# Altium schematic sheet 58. CURRENT MONITORS.SchDoc: CURRENT MONITORS - INA226
size 513 x 386 mm; Project: PROC154E2(001)_SK_AM69; Issue: 1.0; RevCode: E3; Page Create Date: March  8, 1995; Variant Name: Core Design; Schematic Page Number: 58; Page Number: 58; Page Size: C; Comment: MISTRAL_TITLEBLK_CSIZE_1; Page Count: 62; Schematic Page Count: 62; Name: PROC154E2 001 SK AM69; DsnPath: C:\Users\danie\Downloads\sprr466c\PROC154E3_RP\PROC154E3_SCH.DSN; SchematicName: SCHEMATIC1; PageName: 58. CURRENT MONITORS; PageSize: C; TopSchematic: True
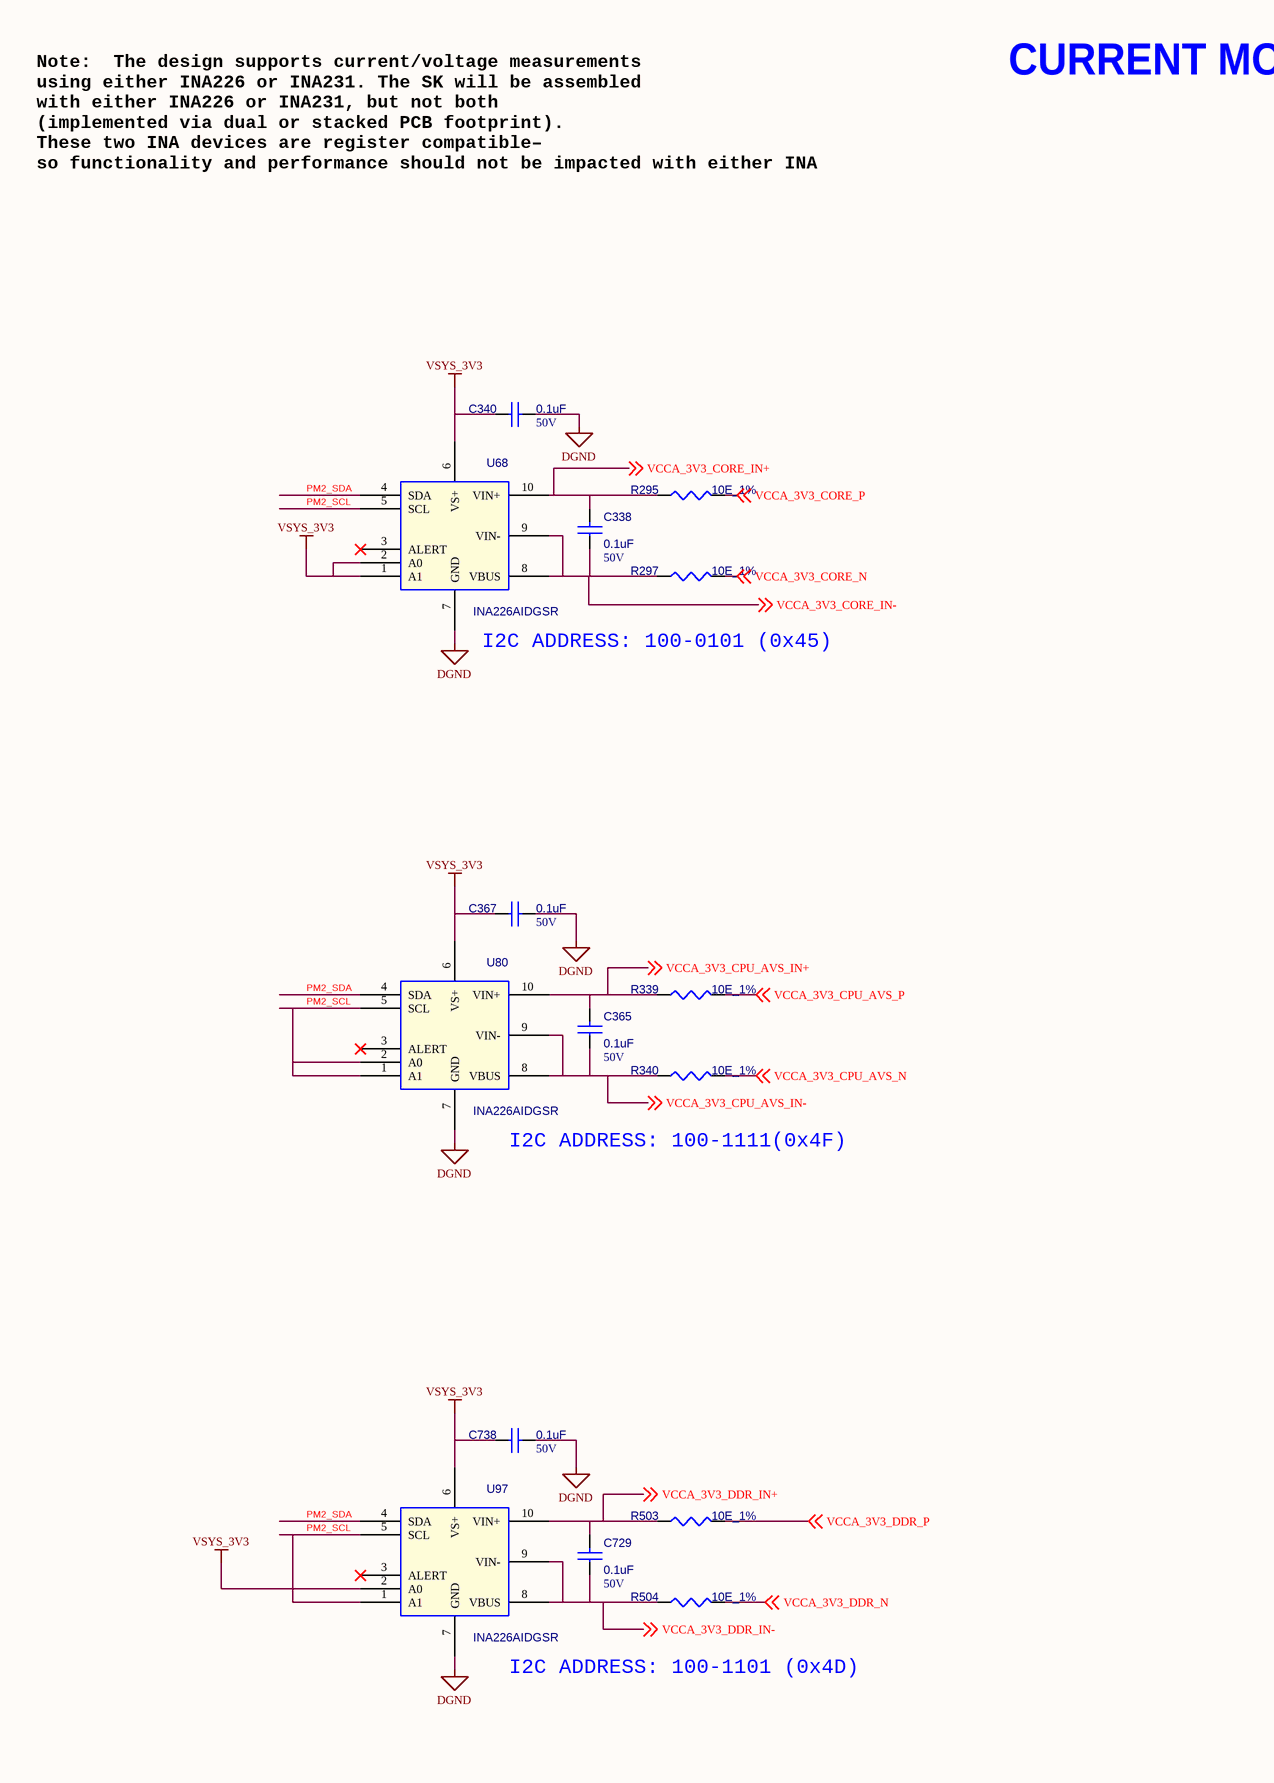
[diagram p0: 58. CURRENT MONITORS.SchDoc, left]
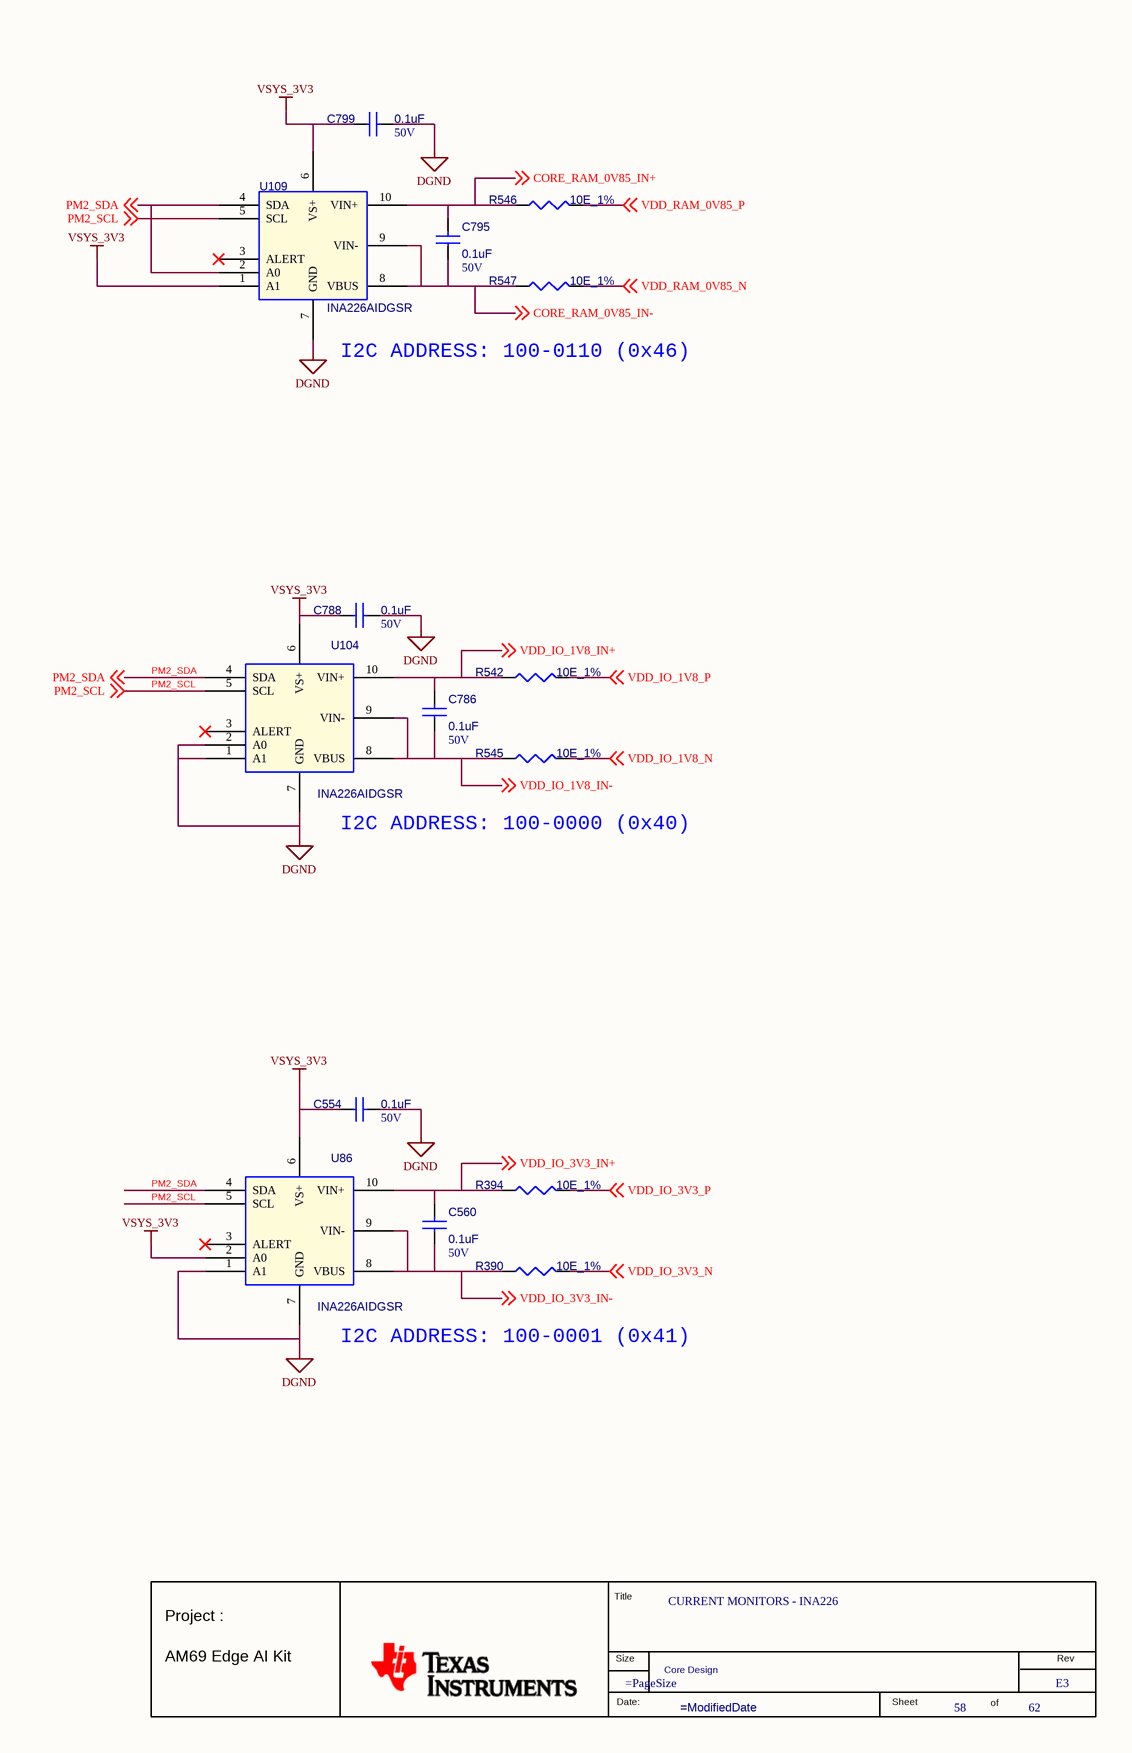
[diagram p1: 58. CURRENT MONITORS.SchDoc, right]

## Parts
*  RevCode: E3  Title: CURRENT MONITORS - INA226  Page Number: 58  Page Count: 62  Variant Name: Core Design  (hidden comment: MISTRAL_TITLEBLK_CSIZE_1)  (graphical)
C338  0.1uF  Voltage: 50V  [CAP0402_0-75]
C340  0.1uF  Voltage: 50V  [CAP0402_0-75]
C365  0.1uF  Voltage: 50V  [CAP0402_0-75]
C367  0.1uF  Voltage: 50V  [CAP0402_0-75]
C554  0.1uF  Voltage: 50V  [CAP0402_0-75]
C560  0.1uF  Voltage: 50V  [CAP0402_0-75]
C729  0.1uF  Voltage: 50V  [CAP0402_0-75]
C738  0.1uF  Voltage: 50V  [CAP0402_0-75]
C786  0.1uF  Voltage: 50V  [CAP0402_0-75]
C788  0.1uF  Voltage: 50V  [CAP0402_0-75]
C795  0.1uF  Voltage: 50V  [CAP0402_0-75]
C799  0.1uF  Voltage: 50V  [CAP0402_0-75]
R295  10E_1%  [RES0402_0-5]
R297  10E_1%  [RES0402_0-5]
R339  10E_1%  [RES0402_0-5]
R340  10E_1%  [RES0402_0-5]
R390  10E_1%  [RES0402_0-5]
R394  10E_1%  [RES0402_0-5]
R503  10E_1%  [RES0402_0-5]
R504  10E_1%  [RES0402_0-5]
R542  10E_1%  [RES0402_0-5]
R545  10E_1%  [RES0402_0-5]
R546  10E_1%  [RES0402_0-5]
R547  10E_1%  [RES0402_0-5]
U68  INA226AIDGSR  [MSOP10_19-68_120X120_1-1]
U80  INA226AIDGSR  [MSOP10_19-68_120X120_1-1]
U86  INA226AIDGSR  [MSOP10_19-68_120X120_1-1]
U97  INA226AIDGSR  [MSOP10_19-68_120X120_1-1]
U104  INA226AIDGSR  [MSOP10_19-68_120X120_1-1]
U109  INA226AIDGSR  [MSOP10_19-68_120X120_1-1]

## Nets
DGND: C340.2 C367.2 C554.2 C738.2 C788.2 C799.2 U68.7(GND) U80.7(GND) U86.1(A1) U86.7(GND) U97.7(GND) U104.1(A1) U104.2(A0) U104.7(GND) U109.7(GND)
VSYS_3V3: C340.1 C367.1 C554.1 C738.1 C788.1 C799.1 U68.1(A1) U68.2(A0) U68.6(VS+) U80.6(VS+) U86.2(A0) U86.6(VS+) U97.2(A0) U97.6(VS+) U104.6(VS+) U109.1(A1) U109.6(VS+)
CORE_RAM_0V85_IN+: C795.2 R546.1 U109.10(VIN+) ; off-sheet CORE_RAM_0V85_IN+
CORE_RAM_0V85_IN-: C795.1 R547.1 U109.8(VBUS) U109.9(VIN-) ; off-sheet CORE_RAM_0V85_IN-
PM2_SCL: U68.5(SCL) U80.1(A1) U80.2(A0) U80.5(SCL) U86.5(SCL) U97.1(A1) U97.5(SCL) U104.5(SCL) U109.5(SCL) ; off-sheet PM2_SCL
PM2_SDA: U68.4(SDA) U80.4(SDA) U86.4(SDA) U97.4(SDA) U104.4(SDA) U109.2(A0) U109.4(SDA) ; off-sheet PM2_SDA
VCCA_3V3_CORE_IN+: C338.2 R295.1 U68.10(VIN+) ; off-sheet VCCA_3V3_CORE_IN+
VCCA_3V3_CORE_IN-: C338.1 R297.1 U68.8(VBUS) U68.9(VIN-) ; off-sheet VCCA_3V3_CORE_IN-
VCCA_3V3_CORE_N: R297.2 ; off-sheet VCCA_3V3_CORE_N
VCCA_3V3_CORE_P: R295.2 ; off-sheet VCCA_3V3_CORE_P
VCCA_3V3_CPU_AVS_IN+: C365.2 R339.1 U80.10(VIN+) ; off-sheet VCCA_3V3_CPU_AVS_IN+
VCCA_3V3_CPU_AVS_IN-: C365.1 R340.1 U80.8(VBUS) U80.9(VIN-) ; off-sheet VCCA_3V3_CPU_AVS_IN-
VCCA_3V3_CPU_AVS_N: R340.2 ; off-sheet VCCA_3V3_CPU_AVS_N
VCCA_3V3_CPU_AVS_P: R339.2 ; off-sheet VCCA_3V3_CPU_AVS_P
VCCA_3V3_DDR_IN+: C729.2 R503.1 U97.10(VIN+) ; off-sheet VCCA_3V3_DDR_IN+
VCCA_3V3_DDR_IN-: C729.1 R504.1 U97.8(VBUS) U97.9(VIN-) ; off-sheet VCCA_3V3_DDR_IN-
VCCA_3V3_DDR_N: R504.2 ; off-sheet VCCA_3V3_DDR_N
VCCA_3V3_DDR_P: R503.2 ; off-sheet VCCA_3V3_DDR_P
VDD_IO_1V8_IN+: C786.2 R542.1 U104.10(VIN+) ; off-sheet VDD_IO_1V8_IN+
VDD_IO_1V8_IN-: C786.1 R545.1 U104.8(VBUS) U104.9(VIN-) ; off-sheet VDD_IO_1V8_IN-
VDD_IO_1V8_N: R545.2 ; off-sheet VDD_IO_1V8_N
VDD_IO_1V8_P: R542.2 ; off-sheet VDD_IO_1V8_P
VDD_IO_3V3_IN+: C560.2 R394.1 U86.10(VIN+) ; off-sheet VDD_IO_3V3_IN+
VDD_IO_3V3_IN-: C560.1 R390.1 U86.8(VBUS) U86.9(VIN-) ; off-sheet VDD_IO_3V3_IN-
VDD_IO_3V3_N: R390.2 ; off-sheet VDD_IO_3V3_N
VDD_IO_3V3_P: R394.2 ; off-sheet VDD_IO_3V3_P
VDD_RAM_0V85_N: R547.2 ; off-sheet VDD_RAM_0V85_N
VDD_RAM_0V85_P: R546.2 ; off-sheet VDD_RAM_0V85_P

Not connected (* = marked no-connect by the designer): U68 3(ALERT)*; U80 3(ALERT)*; U86 3(ALERT)*; U97 3(ALERT)*; U104 3(ALERT)*; U109 3(ALERT)*

## Notes on the sheet
- Note:  The design supports current/voltage measurements
  using either INA226 or INA231. The SK will be assembled
  with either INA226 or INA231, but not both
  (implemented via dual or stacked PCB footprint).
  These two INA devices are register compatible–
  so functionality and performance should not be impacted with either INA
- CURRENT MONITORS - INA226
- I2C ADDRESS: 100-0101 (0x45)
- I2C ADDRESS: 100-0110 (0x46)
- I2C ADDRESS: 100-1111(0x4F)
- I2C ADDRESS: 100-0000 (0x40)
- I2C ADDRESS: 100-0001 (0x41)
- I2C ADDRESS: 100-1101 (0x4D)
- (in symbol MISTRAL_TITLEBLK_CSIZE_1) Title; Project :; Size; Rev; AM69 Edge AI Kit; Date:; Sheet; of

## Library data of the parts
* = MISTRAL_TITLEBLK_CSIZE_1: Issue: 1.0; Project: PROC154E2(001)_SK_AM69; Name: PROC154E2 001 SK AM69; Page Create Date: March  8, 1995; Page Size: =PageSize; Page Modify Date: =ModifiedDate; Schematic Page Count: 62; Schematic Page Number: 58
C338 = CAP_Dup1: CAP CERAMIC 0.1uF 50V 10% X7R 0402; Part Reference: C338; Manufacturer: MURATA; Part_type: CAPACITORS\CERAMIC; Mfr_part_number: GRM155R71H104KE14D; Mistral Part No: 120011100014-R; Direct Alternate_mfr_name: TDK; Direct Alternate_mfr_part_number: C1005X7R1H104K050BE; Automotive Alternate_mfr_part_number: CGA2B3X7R1H104K050BB; Custom_Duty: 15%; Customs_HS_Code: 85322990; Wattage: NA; Project: J7_CP; Value: 0.1uF; PCB Footprint: CAP0402_0-75; MECHANICAL 3D STEP FILE: CAP0402_0-75; Chkd/date: MANIRAJA/261020; Crtd /date: ALVY/211020; Datasheet: Y:\MIS_DATABASE\DATASHEETS\CAPACITORS\GRM155R71H104KE14.PDF; Temperature: -55°C+125°C; Weight: 3.1mg; Height: 0.55MM; Distributor_part_number: 490-10700-1-ND; Distributor_name: DIGIKEY; Package: 0402; Tolerance: 10%; Mfr_name: MURATA; Library Ref: CAP; Footprint Ref: CAP0402_0-75; Library Path: Y:\MIS_DATABASE\Library\ALTIUM_TOOL\SCHEMATICS_PARTS\MS_DISCRETE_Library.schlib; Footprint Path: Y:\MIS_DATABASE\Library\ALTIUM_TOOL\PCB_FOOTPRINTS\Altium_Footprint_Lib.PcbLib; Automotive Alternate_mfr_name: TDK
C340 = CAP_Dup1: CAP CERAMIC 0.1uF 50V 10% X7R 0402; Part Reference: C340; Manufacturer: MURATA; Mistral Part No: 120011100014-R; Mfr_part_number: GRM155R71H104KE14D; Part_type: CAPACITORS\CERAMIC; Direct Alternate_mfr_name: TDK; Direct Alternate_mfr_part_number: C1005X7R1H104K050BE; Automotive Alternate_mfr_part_number: CGA2B3X7R1H104K050BB; Project: J7_CP; Wattage: NA; Customs_HS_Code: 85322990; Custom_Duty: 15%; Value: 0.1uF; PCB Footprint: CAP0402_0-75; MECHANICAL 3D STEP FILE: CAP0402_0-75; Footprint Path: Y:\MIS_DATABASE\Library\ALTIUM_TOOL\PCB_FOOTPRINTS\Altium_Footprint_Lib.PcbLib; Library Path: Y:\MIS_DATABASE\Library\ALTIUM_TOOL\SCHEMATICS_PARTS\MS_DISCRETE_Library.schlib; Footprint Ref: CAP0402_0-75; Library Ref: CAP; Mfr_name: MURATA; Tolerance: 10%; Package: 0402; Distributor_name: DIGIKEY; Distributor_part_number: 490-10700-1-ND; Height: 0.55MM; Weight: 3.1mg; Temperature: -55°C+125°C; Datasheet: Y:\MIS_DATABASE\DATASHEETS\CAPACITORS\GRM155R71H104KE14.PDF; Crtd /date: ALVY/211020; Chkd/date: MANIRAJA/261020; Automotive Alternate_mfr_name: TDK
C365 = CAP_Dup1: CAP CERAMIC 0.1uF 50V 10% X7R 0402; Part Reference: C365; Manufacturer: MURATA; Automotive Alternate_mfr_part_number: CGA2B3X7R1H104K050BB; Automotive Alternate_mfr_name: TDK; Direct Alternate_mfr_part_number: C1005X7R1H104K050BE; Part_type: CAPACITORS\CERAMIC; Mfr_part_number: GRM155R71H104KE14D; Mistral Part No: 120011100014-R; Custom_Duty: 15%; Customs_HS_Code: 85322990; Wattage: NA; Project: J7_CP; Value: 0.1uF; PCB Footprint: CAP0402_0-75; Direct Alternate_mfr_name: TDK; Chkd/date: MANIRAJA/261020; Crtd /date: ALVY/211020; Datasheet: Y:\MIS_DATABASE\DATASHEETS\CAPACITORS\GRM155R71H104KE14.PDF; Temperature: -55°C+125°C; Weight: 3.1mg; Height: 0.55MM; Distributor_part_number: 490-10700-1-ND; Distributor_name: DIGIKEY; Package: 0402; Tolerance: 10%; Mfr_name: MURATA; Library Ref: CAP; Footprint Ref: CAP0402_0-75; Library Path: Y:\MIS_DATABASE\Library\ALTIUM_TOOL\SCHEMATICS_PARTS\MS_DISCRETE_Library.schlib; Footprint Path: Y:\MIS_DATABASE\Library\ALTIUM_TOOL\PCB_FOOTPRINTS\Altium_Footprint_Lib.PcbLib; MECHANICAL 3D STEP FILE: CAP0402_0-75
C367 = CAP_Dup1: CAP CERAMIC 0.1uF 50V 10% X7R 0402; Part Reference: C367; Manufacturer: MURATA; Automotive Alternate_mfr_part_number: CGA2B3X7R1H104K050BB; Automotive Alternate_mfr_name: TDK; Direct Alternate_mfr_part_number: C1005X7R1H104K050BE; Mistral Part No: 120011100014-R; Mfr_part_number: GRM155R71H104KE14D; Part_type: CAPACITORS\CERAMIC; Project: J7_CP; Wattage: NA; Customs_HS_Code: 85322990; Custom_Duty: 15%; Value: 0.1uF; PCB Footprint: CAP0402_0-75; Direct Alternate_mfr_name: TDK; Footprint Path: Y:\MIS_DATABASE\Library\ALTIUM_TOOL\PCB_FOOTPRINTS\Altium_Footprint_Lib.PcbLib; Library Path: Y:\MIS_DATABASE\Library\ALTIUM_TOOL\SCHEMATICS_PARTS\MS_DISCRETE_Library.schlib; Footprint Ref: CAP0402_0-75; Library Ref: CAP; Mfr_name: MURATA; Tolerance: 10%; Package: 0402; Distributor_name: DIGIKEY; Distributor_part_number: 490-10700-1-ND; Height: 0.55MM; Weight: 3.1mg; Temperature: -55°C+125°C; Datasheet: Y:\MIS_DATABASE\DATASHEETS\CAPACITORS\GRM155R71H104KE14.PDF; Crtd /date: ALVY/211020; Chkd/date: MANIRAJA/261020; MECHANICAL 3D STEP FILE: CAP0402_0-75
C554 = CAP_Dup1: CAP CERAMIC 0.1uF 50V 10% X7R 0402; Part Reference: C554; Manufacturer: MURATA; Mistral Part No: 120011100014-R; Mfr_part_number: GRM155R71H104KE14D; Part_type: CAPACITORS\CERAMIC; Direct Alternate_mfr_name: TDK; Direct Alternate_mfr_part_number: C1005X7R1H104K050BE; Automotive Alternate_mfr_part_number: CGA2B3X7R1H104K050BB; Project: J7_CP; Wattage: NA; Customs_HS_Code: 85322990; Custom_Duty: 15%; Value: 0.1uF; PCB Footprint: CAP0402_0-75; MECHANICAL 3D STEP FILE: CAP0402_0-75; Footprint Path: Y:\MIS_DATABASE\Library\ALTIUM_TOOL\PCB_FOOTPRINTS\Altium_Footprint_Lib.PcbLib; Library Path: Y:\MIS_DATABASE\Library\ALTIUM_TOOL\SCHEMATICS_PARTS\MS_DISCRETE_Library.schlib; Footprint Ref: CAP0402_0-75; Library Ref: CAP; Mfr_name: MURATA; Tolerance: 10%; Package: 0402; Distributor_name: DIGIKEY; Distributor_part_number: 490-10700-1-ND; Height: 0.55MM; Weight: 3.1mg; Temperature: -55°C+125°C; Datasheet: Y:\MIS_DATABASE\DATASHEETS\CAPACITORS\GRM155R71H104KE14.PDF; Crtd /date: ALVY/211020; Chkd/date: MANIRAJA/261020; Automotive Alternate_mfr_name: TDK
C560 = CAP_Dup1: CAP CERAMIC 0.1uF 50V 10% X7R 0402; Part Reference: C560; Manufacturer: MURATA; Part_type: CAPACITORS\CERAMIC; Mfr_part_number: GRM155R71H104KE14D; Mistral Part No: 120011100014-R; Direct Alternate_mfr_name: TDK; Direct Alternate_mfr_part_number: C1005X7R1H104K050BE; Automotive Alternate_mfr_part_number: CGA2B3X7R1H104K050BB; Custom_Duty: 15%; Customs_HS_Code: 85322990; Wattage: NA; Project: J7_CP; Value: 0.1uF; PCB Footprint: CAP0402_0-75; MECHANICAL 3D STEP FILE: CAP0402_0-75; Chkd/date: MANIRAJA/261020; Crtd /date: ALVY/211020; Datasheet: Y:\MIS_DATABASE\DATASHEETS\CAPACITORS\GRM155R71H104KE14.PDF; Temperature: -55°C+125°C; Weight: 3.1mg; Height: 0.55MM; Distributor_part_number: 490-10700-1-ND; Distributor_name: DIGIKEY; Package: 0402; Tolerance: 10%; Mfr_name: MURATA; Library Ref: CAP; Footprint Ref: CAP0402_0-75; Library Path: Y:\MIS_DATABASE\Library\ALTIUM_TOOL\SCHEMATICS_PARTS\MS_DISCRETE_Library.schlib; Footprint Path: Y:\MIS_DATABASE\Library\ALTIUM_TOOL\PCB_FOOTPRINTS\Altium_Footprint_Lib.PcbLib; Automotive Alternate_mfr_name: TDK
C729 = CAP_Dup1: CAP CERAMIC 0.1uF 50V 10% X7R 0402; Part Reference: C729; Mistral Part No: 120011100014-R; Mfr_name: MURATA; Mfr_part_number: GRM155R71H104KE14D; Part_type: CAPACITORS\CERAMIC; Direct Alternate_mfr_name: TDK; Direct Alternate_mfr_part_number: C1005X7R1H104K050BE; Automotive Alternate_mfr_part_number: CGA2B3X7R1H104K050BB; Project: J7_CP; Wattage: NA; Customs_HS_Code: 85322990; Custom_Duty: 15%; Value: 0.1uF; PCB Footprint: CAP0402_0-75; MECHANICAL 3D STEP FILE: CAP0402_0-75; Footprint Path: Y:\MIS_DATABASE\Library\ALTIUM_TOOL\PCB_FOOTPRINTS\Altium_Footprint_Lib.PcbLib; Library Path: Y:\MIS_DATABASE\Library\ALTIUM_TOOL\SCHEMATICS_PARTS\MS_DISCRETE_Library.schlib; Footprint Ref: CAP0402_0-75; Library Ref: CAP; Tolerance: 10%; Package: 0402; Distributor_name: DIGIKEY; Distributor_part_number: 490-10700-1-ND; Height: 0.55MM; Weight: 3.1mg; Temperature: -55°C+125°C; Datasheet: Y:\MIS_DATABASE\DATASHEETS\CAPACITORS\GRM155R71H104KE14.PDF; Crtd /date: ALVY/211020; Chkd/date: MANIRAJA/261020; Automotive Alternate_mfr_name: TDK; Manufacturer: MURATA
C738 = CAP_Dup1: CAP CERAMIC 0.1uF 50V 10% X7R 0402; Part Reference: C738; Part_type: CAPACITORS\CERAMIC; Mfr_part_number: GRM155R71H104KE14D; Mfr_name: MURATA; Mistral Part No: 120011100014-R; Direct Alternate_mfr_name: TDK; Direct Alternate_mfr_part_number: C1005X7R1H104K050BE; Automotive Alternate_mfr_part_number: CGA2B3X7R1H104K050BB; Custom_Duty: 15%; Customs_HS_Code: 85322990; Wattage: NA; Project: J7_CP; Value: 0.1uF; PCB Footprint: CAP0402_0-75; MECHANICAL 3D STEP FILE: CAP0402_0-75; Chkd/date: MANIRAJA/261020; Crtd /date: ALVY/211020; Datasheet: Y:\MIS_DATABASE\DATASHEETS\CAPACITORS\GRM155R71H104KE14.PDF; Temperature: -55°C+125°C; Weight: 3.1mg; Height: 0.55MM; Distributor_part_number: 490-10700-1-ND; Distributor_name: DIGIKEY; Package: 0402; Tolerance: 10%; Library Ref: CAP; Footprint Ref: CAP0402_0-75; Library Path: Y:\MIS_DATABASE\Library\ALTIUM_TOOL\SCHEMATICS_PARTS\MS_DISCRETE_Library.schlib; Footprint Path: Y:\MIS_DATABASE\Library\ALTIUM_TOOL\PCB_FOOTPRINTS\Altium_Footprint_Lib.PcbLib; Automotive Alternate_mfr_name: TDK; Manufacturer: MURATA
C786 = CAP_Dup1: CAP CERAMIC 0.1uF 50V 10% X7R 0402; Part Reference: C786; Automotive Alternate_mfr_part_number: CGA2B3X7R1H104K050BB; Automotive Alternate_mfr_name: TDK; Direct Alternate_mfr_part_number: C1005X7R1H104K050BE; Mistral Part No: 120011100014-R; Mfr_name: MURATA; Mfr_part_number: GRM155R71H104KE14D; Part_type: CAPACITORS\CERAMIC; Project: J7_CP; Wattage: NA; Customs_HS_Code: 85322990; Custom_Duty: 15%; Value: 0.1uF; PCB Footprint: CAP0402_0-75; Direct Alternate_mfr_name: TDK; Footprint Path: Y:\MIS_DATABASE\Library\ALTIUM_TOOL\PCB_FOOTPRINTS\Altium_Footprint_Lib.PcbLib; Library Path: Y:\MIS_DATABASE\Library\ALTIUM_TOOL\SCHEMATICS_PARTS\MS_DISCRETE_Library.schlib; Footprint Ref: CAP0402_0-75; Library Ref: CAP; Tolerance: 10%; Package: 0402; Distributor_name: DIGIKEY; Distributor_part_number: 490-10700-1-ND; Height: 0.55MM; Weight: 3.1mg; Temperature: -55°C+125°C; Datasheet: Y:\MIS_DATABASE\DATASHEETS\CAPACITORS\GRM155R71H104KE14.PDF; Crtd /date: ALVY/211020; Chkd/date: MANIRAJA/261020; MECHANICAL 3D STEP FILE: CAP0402_0-75; Manufacturer: MURATA
C788 = CAP_Dup1: CAP CERAMIC 0.1uF 50V 10% X7R 0402; Part Reference: C788; Mistral Part No: 120011100014-R; Mfr_name: MURATA; Mfr_part_number: GRM155R71H104KE14D; Part_type: CAPACITORS\CERAMIC; Direct Alternate_mfr_name: TDK; Direct Alternate_mfr_part_number: C1005X7R1H104K050BE; Automotive Alternate_mfr_part_number: CGA2B3X7R1H104K050BB; Project: J7_CP; Wattage: NA; Customs_HS_Code: 85322990; Custom_Duty: 15%; Value: 0.1uF; PCB Footprint: CAP0402_0-75; MECHANICAL 3D STEP FILE: CAP0402_0-75; Footprint Path: Y:\MIS_DATABASE\Library\ALTIUM_TOOL\PCB_FOOTPRINTS\Altium_Footprint_Lib.PcbLib; Library Path: Y:\MIS_DATABASE\Library\ALTIUM_TOOL\SCHEMATICS_PARTS\MS_DISCRETE_Library.schlib; Footprint Ref: CAP0402_0-75; Library Ref: CAP; Tolerance: 10%; Package: 0402; Distributor_name: DIGIKEY; Distributor_part_number: 490-10700-1-ND; Height: 0.55MM; Weight: 3.1mg; Temperature: -55°C+125°C; Datasheet: Y:\MIS_DATABASE\DATASHEETS\CAPACITORS\GRM155R71H104KE14.PDF; Crtd /date: ALVY/211020; Chkd/date: MANIRAJA/261020; Automotive Alternate_mfr_name: TDK; Manufacturer: MURATA
C795 = CAP_Dup1: CAP CERAMIC 0.1uF 50V 10% X7R 0402; Part Reference: C795; Automotive Alternate_mfr_part_number: CGA2B3X7R1H104K050BB; Automotive Alternate_mfr_name: TDK; Direct Alternate_mfr_part_number: C1005X7R1H104K050BE; Part_type: CAPACITORS\CERAMIC; Mfr_part_number: GRM155R71H104KE14D; Mfr_name: MURATA; Mistral Part No: 120011100014-R; Custom_Duty: 15%; Customs_HS_Code: 85322990; Wattage: NA; Project: J7_CP; Value: 0.1uF; PCB Footprint: CAP0402_0-75; Direct Alternate_mfr_name: TDK; MECHANICAL 3D STEP FILE: CAP0402_0-75; Chkd/date: MANIRAJA/261020; Crtd /date: ALVY/211020; Datasheet: Y:\MIS_DATABASE\DATASHEETS\CAPACITORS\GRM155R71H104KE14.PDF; Temperature: -55°C+125°C; Weight: 3.1mg; Height: 0.55MM; Distributor_part_number: 490-10700-1-ND; Distributor_name: DIGIKEY; Package: 0402; Tolerance: 10%; Library Ref: CAP; Footprint Ref: CAP0402_0-75; Library Path: Y:\MIS_DATABASE\Library\ALTIUM_TOOL\SCHEMATICS_PARTS\MS_DISCRETE_Library.schlib; Footprint Path: Y:\MIS_DATABASE\Library\ALTIUM_TOOL\PCB_FOOTPRINTS\Altium_Footprint_Lib.PcbLib; Manufacturer: MURATA
C799 = CAP_Dup1: CAP CERAMIC 0.1uF 50V 10% X7R 0402; Part Reference: C799; Automotive Alternate_mfr_part_number: CGA2B3X7R1H104K050BB; Automotive Alternate_mfr_name: TDK; Direct Alternate_mfr_part_number: C1005X7R1H104K050BE; Mistral Part No: 120011100014-R; Mfr_name: MURATA; Mfr_part_number: GRM155R71H104KE14D; Part_type: CAPACITORS\CERAMIC; Project: J7_CP; Wattage: NA; Customs_HS_Code: 85322990; Custom_Duty: 15%; Value: 0.1uF; PCB Footprint: CAP0402_0-75; Direct Alternate_mfr_name: TDK; MECHANICAL 3D STEP FILE: CAP0402_0-75; Footprint Path: Y:\MIS_DATABASE\Library\ALTIUM_TOOL\PCB_FOOTPRINTS\Altium_Footprint_Lib.PcbLib; Library Path: Y:\MIS_DATABASE\Library\ALTIUM_TOOL\SCHEMATICS_PARTS\MS_DISCRETE_Library.schlib; Footprint Ref: CAP0402_0-75; Library Ref: CAP; Tolerance: 10%; Package: 0402; Distributor_name: DIGIKEY; Distributor_part_number: 490-10700-1-ND; Height: 0.55MM; Weight: 3.1mg; Temperature: -55°C+125°C; Datasheet: Y:\MIS_DATABASE\DATASHEETS\CAPACITORS\GRM155R71H104KE14.PDF; Crtd /date: ALVY/211020; Chkd/date: MANIRAJA/261020; Manufacturer: MURATA
R295 = RESISTOR_Dup2: RES 10E 1/10W 1% 0402; Part Reference: R295; Manufacturer: PANASONIC-ECG; Mistral Part No: 110009030203-R; Mfr_part_number: ERJ-2RKF10R0X; Part_type: RESISTORS\FIXED; Project: CTP02_REVA_BASE; Voltage: NA; Customs_HS_Code: 85332119; Custom_Duty: 15%; Value: 10E_1%; PCB Footprint: RES0402_0-5; Footprint Ref: RES0402_0-5; Mfr_name: PANASONIC-ECG; Tolerance: 1%; Wattage: 1/10W; Package: 0402; Distributor_name: DIGIKEY; Distributor_part_number: P10.0LCT-ND; Library Ref: RESISTOR; Height: 0.40MM; Weight: 0.8mg; Temperature: -55°C+155°C; Datasheet: Y:\MIS_DATABASE\DATASHEETS\RESISTORS\PAN-ERJSER_NOV17.PDF; Crtd /date: MAZHAR/120505; Chkd/date: VASANTHA/201216; MECHANICAL 3D STEP FILE: RES0402_0-5; Library Path: Y:\MIS_DATABASE\Library\ALTIUM_TOOL\SCHEMATICS_PARTS\MS_DISCRETE_Library.schlib; Footprint Path: Y:\MIS_DATABASE\Library\ALTIUM_TOOL\PCB_FOOTPRINTS\Altium_Footprint_Lib.PcbLib
R297 = RESISTOR_Dup2: RES 10E 1/10W 1% 0402; Part Reference: R297; Manufacturer: PANASONIC-ECG; Part_type: RESISTORS\FIXED; Mfr_part_number: ERJ-2RKF10R0X; Mistral Part No: 110009030203-R; Custom_Duty: 15%; Customs_HS_Code: 85332119; Voltage: NA; Project: CTP02_REVA_BASE; Value: 10E_1%; PCB Footprint: RES0402_0-5; Footprint Path: Y:\MIS_DATABASE\Library\ALTIUM_TOOL\PCB_FOOTPRINTS\Altium_Footprint_Lib.PcbLib; Library Path: Y:\MIS_DATABASE\Library\ALTIUM_TOOL\SCHEMATICS_PARTS\MS_DISCRETE_Library.schlib; MECHANICAL 3D STEP FILE: RES0402_0-5; Chkd/date: VASANTHA/201216; Crtd /date: MAZHAR/120505; Datasheet: Y:\MIS_DATABASE\DATASHEETS\RESISTORS\PAN-ERJSER_NOV17.PDF; Temperature: -55°C+155°C; Weight: 0.8mg; Height: 0.40MM; Library Ref: RESISTOR; Distributor_part_number: P10.0LCT-ND; Distributor_name: DIGIKEY; Package: 0402; Wattage: 1/10W; Tolerance: 1%; Mfr_name: PANASONIC-ECG; Footprint Ref: RES0402_0-5
R339 = RESISTOR_Dup2: RES 10E 1/10W 1% 0402; Part Reference: R339; Manufacturer: PANASONIC-ECG; Mistral Part No: 110009030203-R; Mfr_part_number: ERJ-2RKF10R0X; Part_type: RESISTORS\FIXED; Project: CTP02_REVA_BASE; Voltage: NA; Customs_HS_Code: 85332119; Custom_Duty: 15%; Value: 10E_1%; PCB Footprint: RES0402_0-5; Footprint Ref: RES0402_0-5; Mfr_name: PANASONIC-ECG; Tolerance: 1%; Wattage: 1/10W; Package: 0402; Distributor_name: DIGIKEY; Distributor_part_number: P10.0LCT-ND; Library Ref: RESISTOR; Height: 0.40MM; Weight: 0.8mg; Temperature: -55°C+155°C; Datasheet: Y:\MIS_DATABASE\DATASHEETS\RESISTORS\PAN-ERJSER_NOV17.PDF; Crtd /date: MAZHAR/120505; Chkd/date: VASANTHA/201216; MECHANICAL 3D STEP FILE: RES0402_0-5; Library Path: Y:\MIS_DATABASE\Library\ALTIUM_TOOL\SCHEMATICS_PARTS\MS_DISCRETE_Library.schlib; Footprint Path: Y:\MIS_DATABASE\Library\ALTIUM_TOOL\PCB_FOOTPRINTS\Altium_Footprint_Lib.PcbLib
R340 = RESISTOR_Dup2: RES 10E 1/10W 1% 0402; Part Reference: R340; Manufacturer: PANASONIC-ECG; Part_type: RESISTORS\FIXED; Mfr_part_number: ERJ-2RKF10R0X; Mistral Part No: 110009030203-R; Custom_Duty: 15%; Customs_HS_Code: 85332119; Voltage: NA; Project: CTP02_REVA_BASE; Value: 10E_1%; PCB Footprint: RES0402_0-5; Footprint Path: Y:\MIS_DATABASE\Library\ALTIUM_TOOL\PCB_FOOTPRINTS\Altium_Footprint_Lib.PcbLib; Library Path: Y:\MIS_DATABASE\Library\ALTIUM_TOOL\SCHEMATICS_PARTS\MS_DISCRETE_Library.schlib; MECHANICAL 3D STEP FILE: RES0402_0-5; Chkd/date: VASANTHA/201216; Crtd /date: MAZHAR/120505; Datasheet: Y:\MIS_DATABASE\DATASHEETS\RESISTORS\PAN-ERJSER_NOV17.PDF; Temperature: -55°C+155°C; Weight: 0.8mg; Height: 0.40MM; Library Ref: RESISTOR; Distributor_part_number: P10.0LCT-ND; Distributor_name: DIGIKEY; Package: 0402; Wattage: 1/10W; Tolerance: 1%; Mfr_name: PANASONIC-ECG; Footprint Ref: RES0402_0-5
R390 = RESISTOR_Dup2: RES 10E 1/10W 1% 0402; Part Reference: R390; Manufacturer: PANASONIC-ECG; Part_type: RESISTORS\FIXED; Mfr_part_number: ERJ-2RKF10R0X; Mistral Part No: 110009030203-R; Custom_Duty: 15%; Customs_HS_Code: 85332119; Voltage: NA; Project: CTP02_REVA_BASE; Value: 10E_1%; PCB Footprint: RES0402_0-5; Footprint Path: Y:\MIS_DATABASE\Library\ALTIUM_TOOL\PCB_FOOTPRINTS\Altium_Footprint_Lib.PcbLib; Library Path: Y:\MIS_DATABASE\Library\ALTIUM_TOOL\SCHEMATICS_PARTS\MS_DISCRETE_Library.schlib; MECHANICAL 3D STEP FILE: RES0402_0-5; Chkd/date: VASANTHA/201216; Crtd /date: MAZHAR/120505; Datasheet: Y:\MIS_DATABASE\DATASHEETS\RESISTORS\PAN-ERJSER_NOV17.PDF; Temperature: -55°C+155°C; Weight: 0.8mg; Height: 0.40MM; Library Ref: RESISTOR; Distributor_part_number: P10.0LCT-ND; Distributor_name: DIGIKEY; Package: 0402; Wattage: 1/10W; Tolerance: 1%; Mfr_name: PANASONIC-ECG; Footprint Ref: RES0402_0-5
R394 = RESISTOR_Dup2: RES 10E 1/10W 1% 0402; Part Reference: R394; Manufacturer: PANASONIC-ECG; Mistral Part No: 110009030203-R; Mfr_part_number: ERJ-2RKF10R0X; Part_type: RESISTORS\FIXED; Project: CTP02_REVA_BASE; Voltage: NA; Customs_HS_Code: 85332119; Custom_Duty: 15%; Value: 10E_1%; PCB Footprint: RES0402_0-5; Footprint Ref: RES0402_0-5; Mfr_name: PANASONIC-ECG; Tolerance: 1%; Wattage: 1/10W; Package: 0402; Distributor_name: DIGIKEY; Distributor_part_number: P10.0LCT-ND; Library Ref: RESISTOR; Height: 0.40MM; Weight: 0.8mg; Temperature: -55°C+155°C; Datasheet: Y:\MIS_DATABASE\DATASHEETS\RESISTORS\PAN-ERJSER_NOV17.PDF; Crtd /date: MAZHAR/120505; Chkd/date: VASANTHA/201216; MECHANICAL 3D STEP FILE: RES0402_0-5; Library Path: Y:\MIS_DATABASE\Library\ALTIUM_TOOL\SCHEMATICS_PARTS\MS_DISCRETE_Library.schlib; Footprint Path: Y:\MIS_DATABASE\Library\ALTIUM_TOOL\PCB_FOOTPRINTS\Altium_Footprint_Lib.PcbLib
R503 = RESISTOR_Dup2: RES 10E 1/10W 1% 0402; Part Reference: R503; Part_type: RESISTORS\FIXED; Mfr_part_number: ERJ-2RKF10R0X; Mfr_name: PANASONIC-ECG; Mistral Part No: 110009030203-R; Custom_Duty: 15%; Customs_HS_Code: 85332119; Voltage: NA; Project: CTP02_REVA_BASE; Value: 10E_1%; PCB Footprint: RES0402_0-5; Footprint Path: Y:\MIS_DATABASE\Library\ALTIUM_TOOL\PCB_FOOTPRINTS\Altium_Footprint_Lib.PcbLib; Library Path: Y:\MIS_DATABASE\Library\ALTIUM_TOOL\SCHEMATICS_PARTS\MS_DISCRETE_Library.schlib; MECHANICAL 3D STEP FILE: RES0402_0-5; Chkd/date: VASANTHA/201216; Crtd /date: MAZHAR/120505; Datasheet: Y:\MIS_DATABASE\DATASHEETS\RESISTORS\PAN-ERJSER_NOV17.PDF; Temperature: -55°C+155°C; Weight: 0.8mg; Height: 0.40MM; Library Ref: RESISTOR; Distributor_part_number: P10.0LCT-ND; Distributor_name: DIGIKEY; Package: 0402; Wattage: 1/10W; Tolerance: 1%; Footprint Ref: RES0402_0-5; Manufacturer: PANASONIC-ECG
R504 = RESISTOR_Dup2: RES 10E 1/10W 1% 0402; Part Reference: R504; Mistral Part No: 110009030203-R; Mfr_name: PANASONIC-ECG; Mfr_part_number: ERJ-2RKF10R0X; Part_type: RESISTORS\FIXED; Project: CTP02_REVA_BASE; Voltage: NA; Customs_HS_Code: 85332119; Custom_Duty: 15%; Value: 10E_1%; PCB Footprint: RES0402_0-5; Footprint Ref: RES0402_0-5; Tolerance: 1%; Wattage: 1/10W; Package: 0402; Distributor_name: DIGIKEY; Distributor_part_number: P10.0LCT-ND; Library Ref: RESISTOR; Height: 0.40MM; Weight: 0.8mg; Temperature: -55°C+155°C; Datasheet: Y:\MIS_DATABASE\DATASHEETS\RESISTORS\PAN-ERJSER_NOV17.PDF; Crtd /date: MAZHAR/120505; Chkd/date: VASANTHA/201216; MECHANICAL 3D STEP FILE: RES0402_0-5; Library Path: Y:\MIS_DATABASE\Library\ALTIUM_TOOL\SCHEMATICS_PARTS\MS_DISCRETE_Library.schlib; Footprint Path: Y:\MIS_DATABASE\Library\ALTIUM_TOOL\PCB_FOOTPRINTS\Altium_Footprint_Lib.PcbLib; Manufacturer: PANASONIC-ECG
R542 = RESISTOR_Dup2: RES 10E 1/10W 1% 0402; Part Reference: R542; Part_type: RESISTORS\FIXED; Mfr_part_number: ERJ-2RKF10R0X; Mfr_name: PANASONIC-ECG; Mistral Part No: 110009030203-R; Custom_Duty: 15%; Customs_HS_Code: 85332119; Voltage: NA; Project: CTP02_REVA_BASE; Value: 10E_1%; PCB Footprint: RES0402_0-5; Footprint Path: Y:\MIS_DATABASE\Library\ALTIUM_TOOL\PCB_FOOTPRINTS\Altium_Footprint_Lib.PcbLib; Library Path: Y:\MIS_DATABASE\Library\ALTIUM_TOOL\SCHEMATICS_PARTS\MS_DISCRETE_Library.schlib; MECHANICAL 3D STEP FILE: RES0402_0-5; Chkd/date: VASANTHA/201216; Crtd /date: MAZHAR/120505; Datasheet: Y:\MIS_DATABASE\DATASHEETS\RESISTORS\PAN-ERJSER_NOV17.PDF; Temperature: -55°C+155°C; Weight: 0.8mg; Height: 0.40MM; Library Ref: RESISTOR; Distributor_part_number: P10.0LCT-ND; Distributor_name: DIGIKEY; Package: 0402; Wattage: 1/10W; Tolerance: 1%; Footprint Ref: RES0402_0-5; Manufacturer: PANASONIC-ECG
R545 = RESISTOR_Dup2: RES 10E 1/10W 1% 0402; Part Reference: R545; Mistral Part No: 110009030203-R; Mfr_name: PANASONIC-ECG; Mfr_part_number: ERJ-2RKF10R0X; Part_type: RESISTORS\FIXED; Project: CTP02_REVA_BASE; Voltage: NA; Customs_HS_Code: 85332119; Custom_Duty: 15%; Value: 10E_1%; PCB Footprint: RES0402_0-5; Footprint Ref: RES0402_0-5; Tolerance: 1%; Wattage: 1/10W; Package: 0402; Distributor_name: DIGIKEY; Distributor_part_number: P10.0LCT-ND; Library Ref: RESISTOR; Height: 0.40MM; Weight: 0.8mg; Temperature: -55°C+155°C; Datasheet: Y:\MIS_DATABASE\DATASHEETS\RESISTORS\PAN-ERJSER_NOV17.PDF; Crtd /date: MAZHAR/120505; Chkd/date: VASANTHA/201216; MECHANICAL 3D STEP FILE: RES0402_0-5; Library Path: Y:\MIS_DATABASE\Library\ALTIUM_TOOL\SCHEMATICS_PARTS\MS_DISCRETE_Library.schlib; Footprint Path: Y:\MIS_DATABASE\Library\ALTIUM_TOOL\PCB_FOOTPRINTS\Altium_Footprint_Lib.PcbLib; Manufacturer: PANASONIC-ECG
R546 = RESISTOR_Dup2: RES 10E 1/10W 1% 0402; Part Reference: R546; Mistral Part No: 110009030203-R; Mfr_name: PANASONIC-ECG; Mfr_part_number: ERJ-2RKF10R0X; Part_type: RESISTORS\FIXED; Project: CTP02_REVA_BASE; Voltage: NA; Customs_HS_Code: 85332119; Custom_Duty: 15%; Value: 10E_1%; PCB Footprint: RES0402_0-5; Footprint Ref: RES0402_0-5; Tolerance: 1%; Wattage: 1/10W; Package: 0402; Distributor_name: DIGIKEY; Distributor_part_number: P10.0LCT-ND; Library Ref: RESISTOR; Height: 0.40MM; Weight: 0.8mg; Temperature: -55°C+155°C; Datasheet: Y:\MIS_DATABASE\DATASHEETS\RESISTORS\PAN-ERJSER_NOV17.PDF; Crtd /date: MAZHAR/120505; Chkd/date: VASANTHA/201216; MECHANICAL 3D STEP FILE: RES0402_0-5; Library Path: Y:\MIS_DATABASE\Library\ALTIUM_TOOL\SCHEMATICS_PARTS\MS_DISCRETE_Library.schlib; Footprint Path: Y:\MIS_DATABASE\Library\ALTIUM_TOOL\PCB_FOOTPRINTS\Altium_Footprint_Lib.PcbLib; Manufacturer: PANASONIC-ECG
R547 = RESISTOR_Dup2: RES 10E 1/10W 1% 0402; Part Reference: R547; Part_type: RESISTORS\FIXED; Mfr_part_number: ERJ-2RKF10R0X; Mfr_name: PANASONIC-ECG; Mistral Part No: 110009030203-R; Custom_Duty: 15%; Customs_HS_Code: 85332119; Voltage: NA; Project: CTP02_REVA_BASE; Value: 10E_1%; PCB Footprint: RES0402_0-5; Footprint Path: Y:\MIS_DATABASE\Library\ALTIUM_TOOL\PCB_FOOTPRINTS\Altium_Footprint_Lib.PcbLib; Library Path: Y:\MIS_DATABASE\Library\ALTIUM_TOOL\SCHEMATICS_PARTS\MS_DISCRETE_Library.schlib; MECHANICAL 3D STEP FILE: RES0402_0-5; Chkd/date: VASANTHA/201216; Crtd /date: MAZHAR/120505; Datasheet: Y:\MIS_DATABASE\DATASHEETS\RESISTORS\PAN-ERJSER_NOV17.PDF; Temperature: -55°C+155°C; Weight: 0.8mg; Height: 0.40MM; Library Ref: RESISTOR; Distributor_part_number: P10.0LCT-ND; Distributor_name: DIGIKEY; Package: 0402; Wattage: 1/10W; Tolerance: 1%; Footprint Ref: RES0402_0-5; Manufacturer: PANASONIC-ECG
U68 = INA226AIDGS_MSOP10: IC BI-DIRECTIONAL CURRENT MONITER MSOP10; Part Reference: U68; Manufacturer: TEXAS INSTRUMENTS; Part_type: ICS\INTERFACE; Mistral Part No: 141011080019-R; Automotive Alternate_mfr_part_number: INA226AQDGSRQ1; Custom_Duty: 15%; Customs_HS_Code: 85423100; Wattage: NA; Project: DM385EVM_BASE-BOARD; Value: INA226AIDGSR; PCB Footprint: MSOP10_19-68_120X120_1-1; MECHANICAL 3D STEP FILE: MSOP10_19-68_120X120_1-1; Chkd/date: MANIRAJA/050417; Crtd /date: MANIRAJA/050417; Datasheet: Y:\MIS_DATABASE\DATASHEETS\ICS\INTERFACE\INA226.PDF; Temperature: -40°C+125°C; Weight: NA; Height: 1.10MM; Distributor_part_number: 296-29034-1-ND; Distributor_name: DIGIKEY; Package: MSOP10; Voltage: NA; Tolerance: NA; Mfr_part_number: INA226AIDGSR; Mfr_name: TEXAS INSTRUMENTS; Library Ref: INA226AIDGS_MSOP10; Footprint Ref: MSOP10_19-68_120X120_1-1; Library Path: Y:\MIS_DATABASE\Library\ALTIUM_TOOL\SCHEMATICS_PARTS\MS_MISCINTERFACE_Library.schlib; Footprint Path: Y:\MIS_DATABASE\Library\ALTIUM_TOOL\PCB_FOOTPRINTS\Altium_Footprint_Lib.PcbLib; Automotive Alternate_mfr_name: TEXAS INSTRUMENTS
U80 = INA226AIDGS_MSOP10: IC BI-DIRECTIONAL CURRENT MONITER MSOP10; Part Reference: U80; Manufacturer: TEXAS INSTRUMENTS; Automotive Alternate_mfr_part_number: INA226AQDGSRQ1; Mistral Part No: 141011080019-R; Part_type: ICS\INTERFACE; Project: DM385EVM_BASE-BOARD; Tolerance: NA; Customs_HS_Code: 85423100; Custom_Duty: 15%; Value: INA226AIDGSR; PCB Footprint: MSOP10_19-68_120X120_1-1; Automotive Alternate_mfr_name: TEXAS INSTRUMENTS; Footprint Path: Y:\MIS_DATABASE\Library\ALTIUM_TOOL\PCB_FOOTPRINTS\Altium_Footprint_Lib.PcbLib; Library Path: Y:\MIS_DATABASE\Library\ALTIUM_TOOL\SCHEMATICS_PARTS\MS_MISCINTERFACE_Library.schlib; Footprint Ref: MSOP10_19-68_120X120_1-1; Library Ref: INA226AIDGS_MSOP10; Mfr_name: TEXAS INSTRUMENTS; Mfr_part_number: INA226AIDGSR; Voltage: NA; Wattage: NA; Package: MSOP10; Distributor_name: DIGIKEY; Distributor_part_number: 296-29034-1-ND; Height: 1.10MM; Weight: NA; Temperature: -40°C+125°C; Datasheet: Y:\MIS_DATABASE\DATASHEETS\ICS\INTERFACE\INA226.PDF; Crtd /date: MANIRAJA/050417; Chkd/date: MANIRAJA/050417; MECHANICAL 3D STEP FILE: MSOP10_19-68_120X120_1-1
U86 = INA226AIDGS_MSOP10: IC BI-DIRECTIONAL CURRENT MONITER MSOP10; Part Reference: U86; Manufacturer: TEXAS INSTRUMENTS; Part_type: ICS\INTERFACE; Mistral Part No: 141011080019-R; Automotive Alternate_mfr_part_number: INA226AQDGSRQ1; Custom_Duty: 15%; Customs_HS_Code: 85423100; Wattage: NA; Project: DM385EVM_BASE-BOARD; Value: INA226AIDGSR; PCB Footprint: MSOP10_19-68_120X120_1-1; MECHANICAL 3D STEP FILE: MSOP10_19-68_120X120_1-1; Chkd/date: MANIRAJA/050417; Crtd /date: MANIRAJA/050417; Datasheet: Y:\MIS_DATABASE\DATASHEETS\ICS\INTERFACE\INA226.PDF; Temperature: -40°C+125°C; Weight: NA; Height: 1.10MM; Distributor_part_number: 296-29034-1-ND; Distributor_name: DIGIKEY; Package: MSOP10; Voltage: NA; Tolerance: NA; Mfr_part_number: INA226AIDGSR; Mfr_name: TEXAS INSTRUMENTS; Library Ref: INA226AIDGS_MSOP10; Footprint Ref: MSOP10_19-68_120X120_1-1; Library Path: Y:\MIS_DATABASE\Library\ALTIUM_TOOL\SCHEMATICS_PARTS\MS_MISCINTERFACE_Library.schlib; Footprint Path: Y:\MIS_DATABASE\Library\ALTIUM_TOOL\PCB_FOOTPRINTS\Altium_Footprint_Lib.PcbLib; Automotive Alternate_mfr_name: TEXAS INSTRUMENTS
U97 = INA226AIDGS_MSOP10: IC BI-DIRECTIONAL CURRENT MONITER MSOP10; Part Reference: U97; Mistral Part No: 141011080019-R; Mfr_name: TEXAS INSTRUMENTS; Part_type: ICS\INTERFACE; Automotive Alternate_mfr_part_number: INA226AQDGSRQ1; Project: DM385EVM_BASE-BOARD; Tolerance: NA; Customs_HS_Code: 85423100; Custom_Duty: 15%; Value: INA226AIDGSR; PCB Footprint: MSOP10_19-68_120X120_1-1; Footprint Path: Y:\MIS_DATABASE\Library\ALTIUM_TOOL\PCB_FOOTPRINTS\Altium_Footprint_Lib.PcbLib; Library Path: Y:\MIS_DATABASE\Library\ALTIUM_TOOL\SCHEMATICS_PARTS\MS_MISCINTERFACE_Library.schlib; Footprint Ref: MSOP10_19-68_120X120_1-1; Library Ref: INA226AIDGS_MSOP10; Mfr_part_number: INA226AIDGSR; Voltage: NA; Wattage: NA; Package: MSOP10; Distributor_name: DIGIKEY; Distributor_part_number: 296-29034-1-ND; Height: 1.10MM; Weight: NA; Temperature: -40°C+125°C; Datasheet: Y:\MIS_DATABASE\DATASHEETS\ICS\INTERFACE\INA226.PDF; Crtd /date: MANIRAJA/050417; Chkd/date: MANIRAJA/050417; MECHANICAL 3D STEP FILE: MSOP10_19-68_120X120_1-1; Automotive Alternate_mfr_name: TEXAS INSTRUMENTS; Manufacturer: TEXAS INSTRUMENTS
U104 = INA226AIDGS_MSOP10: IC BI-DIRECTIONAL CURRENT MONITER MSOP10; Part Reference: U104; Automotive Alternate_mfr_part_number: INA226AQDGSRQ1; Automotive Alternate_mfr_name: TEXAS INSTRUMENTS; Mistral Part No: 141011080019-R; Part_type: ICS\INTERFACE; Project: DM385EVM_BASE-BOARD; Tolerance: NA; Customs_HS_Code: 85423100; Custom_Duty: 15%; Value: INA226AIDGSR; PCB Footprint: MSOP10_19-68_120X120_1-1; Footprint Path: Y:\MIS_DATABASE\Library\ALTIUM_TOOL\PCB_FOOTPRINTS\Altium_Footprint_Lib.PcbLib; Library Path: Y:\MIS_DATABASE\Library\ALTIUM_TOOL\SCHEMATICS_PARTS\MS_MISCINTERFACE_Library.schlib; Footprint Ref: MSOP10_19-68_120X120_1-1; Library Ref: INA226AIDGS_MSOP10; Mfr_name: TEXAS INSTRUMENTS; Mfr_part_number: INA226AIDGSR; Voltage: NA; Wattage: NA; Package: MSOP10; Distributor_name: DIGIKEY; Distributor_part_number: 296-29034-1-ND; Height: 1.10MM; Weight: NA; Temperature: -40°C+125°C; Datasheet: Y:\MIS_DATABASE\DATASHEETS\ICS\INTERFACE\INA226.PDF; Crtd /date: MANIRAJA/050417; Chkd/date: MANIRAJA/050417; MECHANICAL 3D STEP FILE: MSOP10_19-68_120X120_1-1; Manufacturer: TEXAS INSTRUMENTS
U109 = INA226AIDGS_MSOP10: IC BI-DIRECTIONAL CURRENT MONITER MSOP10; Part Reference: U109; Manufacturer: TEXAS INSTRUMENTS; Mistral Part No: 141011080019-R; Part_type: ICS\INTERFACE; Automotive Alternate_mfr_part_number: INA226AQDGSRQ1; Project: DM385EVM_BASE-BOARD; Tolerance: NA; Customs_HS_Code: 85423100; Custom_Duty: 15%; Value: INA226AIDGSR; PCB Footprint: MSOP10_19-68_120X120_1-1; Footprint Path: Y:\MIS_DATABASE\Library\ALTIUM_TOOL\PCB_FOOTPRINTS\Altium_Footprint_Lib.PcbLib; Library Path: Y:\MIS_DATABASE\Library\ALTIUM_TOOL\SCHEMATICS_PARTS\MS_MISCINTERFACE_Library.schlib; Footprint Ref: MSOP10_19-68_120X120_1-1; Library Ref: INA226AIDGS_MSOP10; Mfr_name: TEXAS INSTRUMENTS; Mfr_part_number: INA226AIDGSR; Voltage: NA; Wattage: NA; Package: MSOP10; Distributor_name: DIGIKEY; Distributor_part_number: 296-29034-1-ND; Height: 1.10MM; Weight: NA; Temperature: -40°C+125°C; Datasheet: Y:\MIS_DATABASE\DATASHEETS\ICS\INTERFACE\INA226.PDF; Crtd /date: MANIRAJA/050417; Chkd/date: MANIRAJA/050417; MECHANICAL 3D STEP FILE: MSOP10_19-68_120X120_1-1; Automotive Alternate_mfr_name: TEXAS INSTRUMENTS